# EAGLE design diodeBoardV2 (EAGLE 9.5.0)
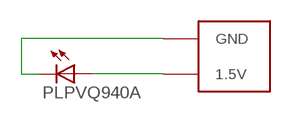
[diagram p0: schematic, sheet 1]

## Parts
U$1  PLPVQ940A  [PLPVQ940A]
U$2  2PIN  [2PIN]

## Nets
N$1: U$1.P$1(A) U$2.P$2(1.5V)
N$2: U$1.P$2(C) U$2.P$1(GND)

## Library data of the parts
U$1 = _HenrySilva:PLPVQ940A
U$2 = _HenrySilva:2PIN

## Board
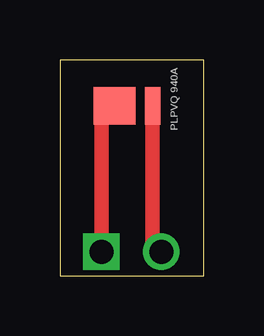
[diagram p1: board, top side]

Size 6 x 9 mm. Coordinates in mm from the lower left corner, seen from the top.
Outline: 0,0 6,0 6,9 0,9 0,0
Copper layers (1*16): Top 0.035mm / dielectric 1.5mm / Bottom 0.035mm
Design rules "default": minimum track width 6mil, minimum drill 0.35mm, track to track 6mil, track to pad 6mil, pad to pad 6mil, via to via 6mil, smd to smd 6mil, copper to edge 40mil, drill to drill 6mil, minimum pad ring 10mil, minimum via ring 8mil, stop-mask expansion 4mil, vias tented up to drill 0mil, thermal gap 10mil

### Footprints (pad centres in the part's own frame; a part is rotated, then mirrored left to right if it is on the bottom)
PLPVQ940A = smd 1.55 x 0.65: P$1 0.78,0.33 | smd 1.55 x 1.75: P$2 0.78,1.925
2PIN = drill 1 square: P$1 -1.27,0 | drill 1: P$2 1.23,0

### Placement (x,y rotation side)
U$1  4.2,6.3 90 top
U$2  3,1 0 top

### Tracks (layer width: path | path; a pad name or v marks a point on that pad's centre or on a via)
N$1
  Top 0.406: U$2.P$2 3.87,1.36
  Top 0.61: 3.87,1.36 U$1.P$1
N$2
  Top 0.406: 1.73,6.54 U$1.P$2
  Top 0.61: U$2.P$1 1.73,6.54